# Altium schematic sheet 01 - Block Diagram.SchDoc
size B; CompanyName: Microchip Technology Inc.; Organization: Microchip Technology; Address1: 2355 West Chandler Blvd.; Address2: Chandler, AZ  85224; Address4: USA; DocumentNumber: 1; SheetNumber: 1; SheetTotal: 15; SheetTitle: Block Diagram; Time: Time
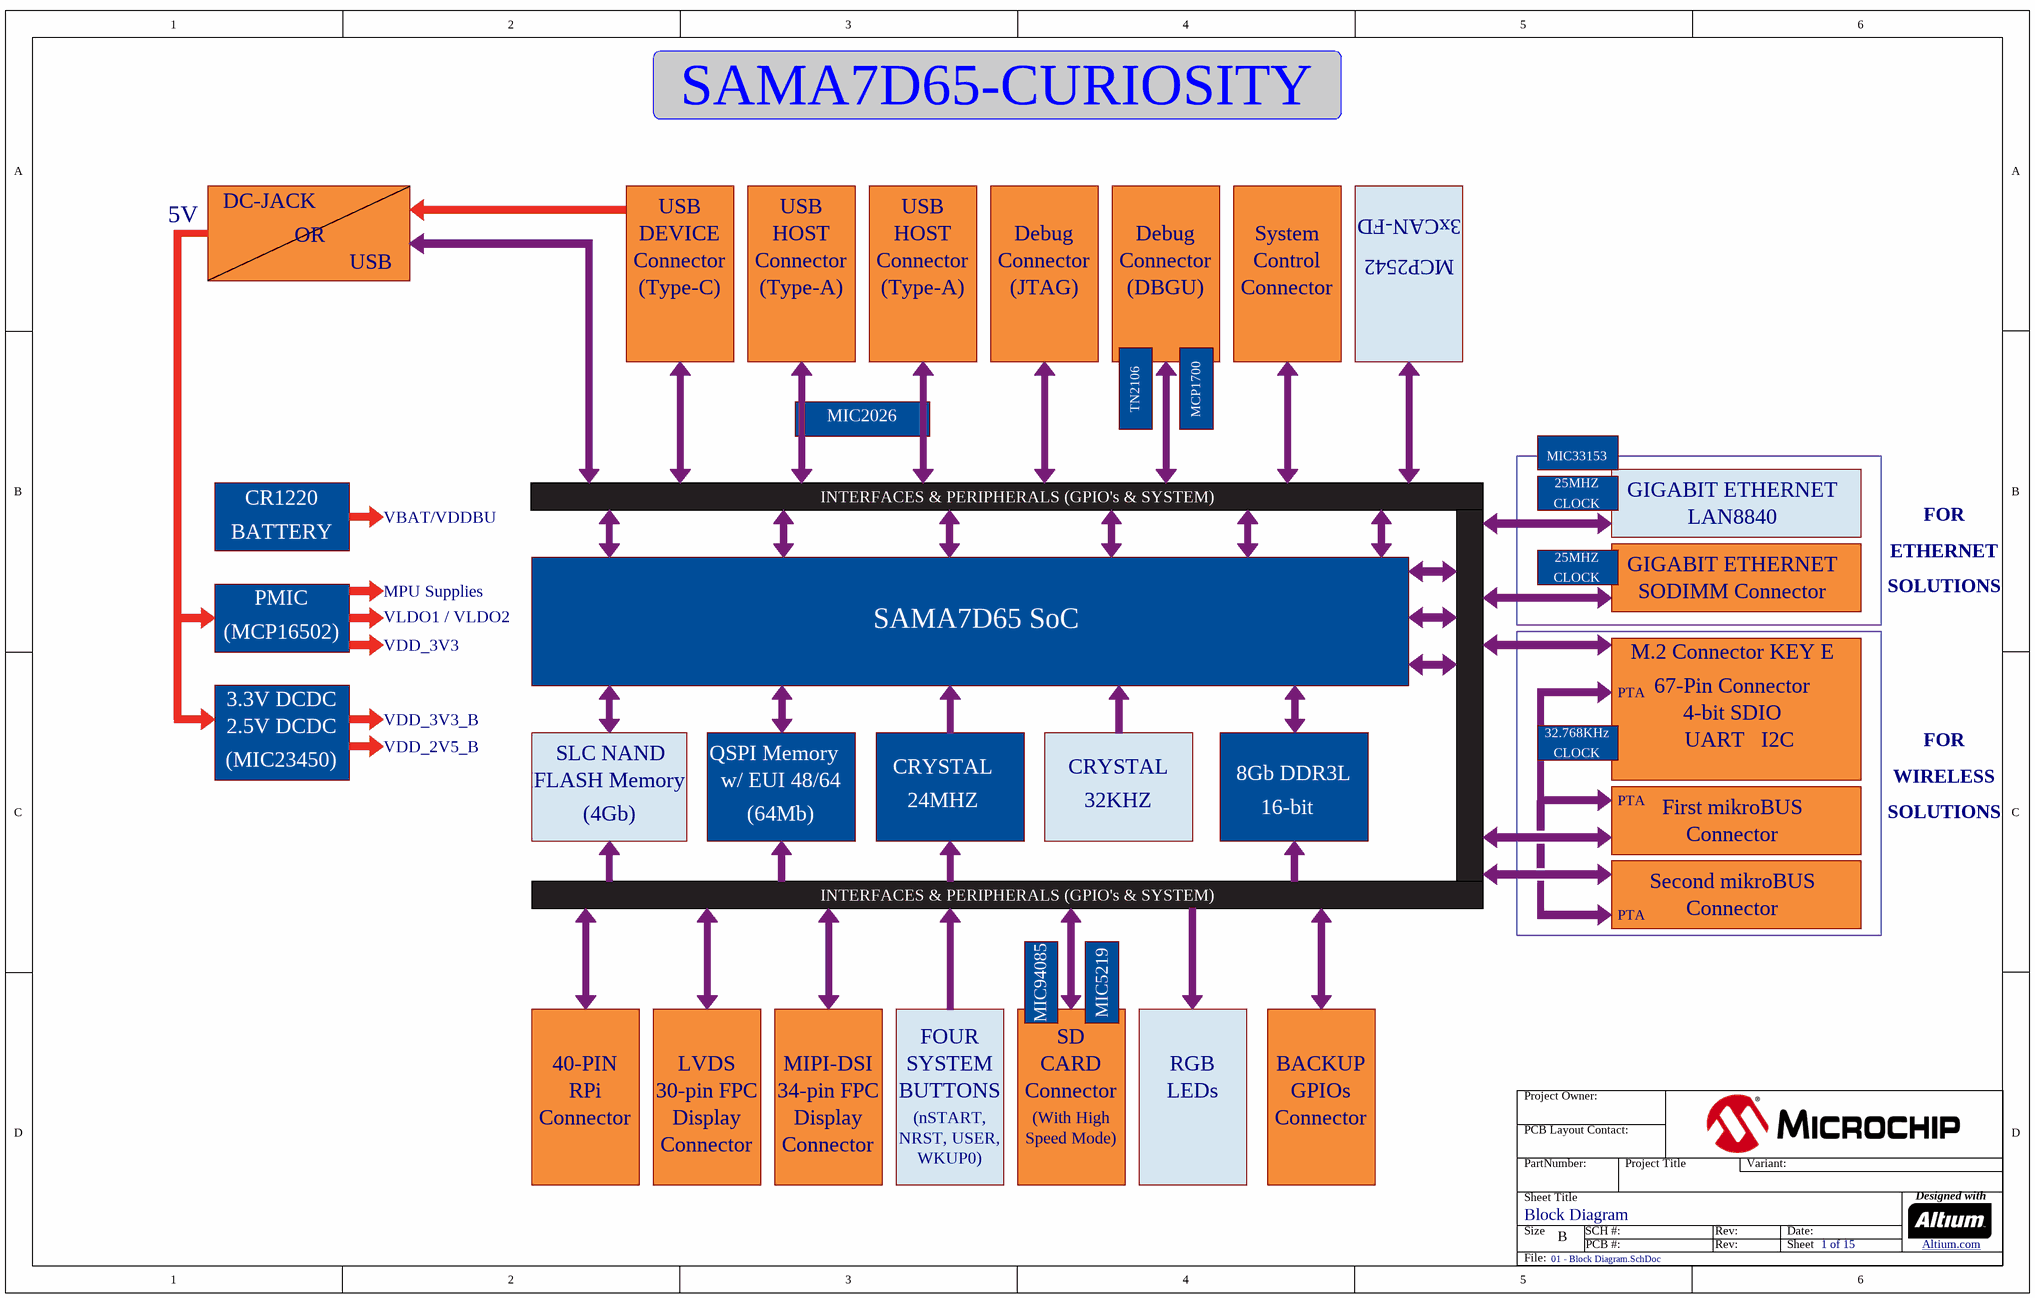
[diagram p0: 01 - Block Diagram.SchDoc]

## Notes on the sheet
- SAMA7D65-CURIOSITY
- 5V
- DC-JACK
- OR
- DEVICE
- USB
- HOST
- Debug
- System
- 3xCAN-FD
- (Type-C)
- Connector
- (Type-A)
- (JTAG)
- (DBGU)
- Control
- MCP2542
- MIC2026
- TN2106
- MCP1700
- CR1220
- VBAT/VDDBU
- INTERFACES & PERIPHERALS (GPIO's & SYSTEM)
- 25MHZ
- CLOCK
- MIC33153
- LAN8840
- GIGABIT ETHERNET
- FOR
- BATTERY
- ETHERNET
- PMIC
- (MCP16502)
- MPU Supplies
- VLDO1 / VLDO2
- VDD_3V3
- SAMA7D65 SoC
- M.2 Connector KEY E
- SODIMM Connector
- SOLUTIONS
- 1.8V DCDC
- 3.3V DCDC
- PTA
- 67-Pin Connector
- 4-bit SDIO
- (MIC5353)
- 2.5V DCDC
- (MIC23450)
- VDD_3V3_B
- VDD_2V5_B
- FLASH Memory
- SLC NAND
- QSPI Memory
- w/ EUI 48/64
- CRYSTAL
- 8Gb DDR3L
- 32.768KHz
- UART   I2C
- WIRELESS
- (4Gb)
- (64Mb)
- 24MHZ
- 32KHZ
- 16-bit
- First mikroBUS
- Second mikroBUS
- MIC94085
- MIC5219
- FOUR
- SD
- RPi
- 40-PIN
- LVDS
- Display
- 30-pin FPC
- MIPI-DSI
- 34-pin FPC
- SYSTEM
- BUTTONS
- (nSTART,
- CARD
- (With High
- RGB
- LEDs
- BACKUP
- GPIOs
- NRST, USER,
- WKUP0)
- Speed Mode)
- Project Owner:
- PCB Layout Contact:
- PartNumber:
- Project Title
- Variant:
- Sheet Title
- Size
- B
- SCH #:
- PCB #:
- Rev:
- Date:
- Sheet
- Designed with
- Altium.com <http://go.altium.com/MicrochipLandingPage_Evaluation.html>
- File: